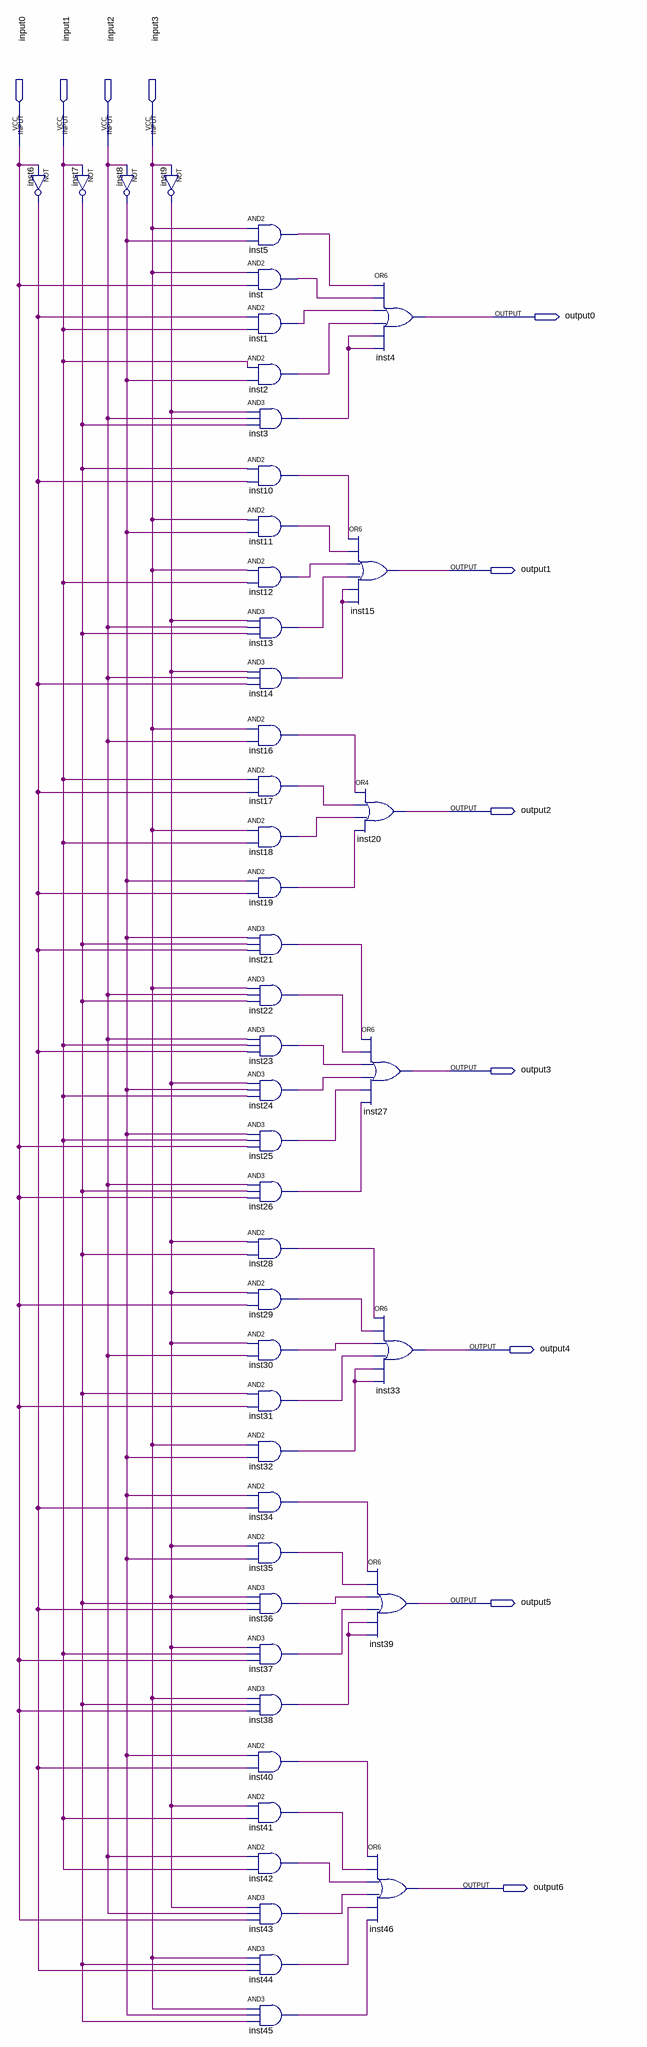
[diagram p0: schematic sheet]
// Quartus schematic segled.bdf as structural Verilog: 47 symbols, 11 pins
module segled (
  input  input0,
  input  input1,
  input  input2,
  input  input3,
  output output0,
  output output1,
  output output2,
  output output3,
  output output4,
  output output5,
  output output6
);

  wire inst1_out, inst2_out, inst3_out, inst5_out, inst6_out, inst7_out, inst8_out, inst9_out, inst10_out,
       inst11_out, inst12_out, inst13_out, inst14_out, inst16_out, inst17_out, inst18_out, inst19_out,
       inst21_out, inst22_out, inst23_out, inst24_out, inst25_out, inst26_out, inst28_out, inst29_out,
       inst30_out, inst31_out, inst32_out, inst34_out, inst35_out, inst36_out, inst37_out, inst38_out,
       inst40_out, inst41_out, inst42_out, inst43_out, inst44_out, inst45_out, inst_out;

  not inst6 (inst6_out, input0);
  not inst7 (inst7_out, input1);
  not inst8 (inst8_out, input2);
  not inst9 (inst9_out, input3);
  and inst5 (inst5_out, input3, inst8_out);
  and inst (inst_out, input3, input0);
  and inst1 (inst1_out, inst6_out, input1);
  and inst2 (inst2_out, input1, inst8_out);
  and inst3 (inst3_out, inst9_out, input2, inst7_out);
  and inst10 (inst10_out, inst7_out, inst6_out);
  and inst11 (inst11_out, input3, inst8_out);
  and inst12 (inst12_out, input3, input1);
  and inst13 (inst13_out, inst9_out, input2, inst7_out);
  and inst14 (inst14_out, inst9_out, input2, inst6_out);
  and inst16 (inst16_out, input3, input2);
  and inst17 (inst17_out, input1, inst6_out);
  and inst18 (inst18_out, input3, input1);
  and inst19 (inst19_out, inst8_out, inst6_out);
  and inst21 (inst21_out, inst8_out, inst7_out, inst6_out);
  and inst22 (inst22_out, input3, input2, inst7_out);
  and inst23 (inst23_out, input2, input1, inst6_out);
  and inst24 (inst24_out, inst9_out, inst8_out, input1);
  and inst25 (inst25_out, inst8_out, input1, input0);
  and inst26 (inst26_out, input2, inst7_out, input0);
  and inst28 (inst28_out, inst9_out, inst7_out);
  and inst29 (inst29_out, inst9_out, input0);
  and inst30 (inst30_out, inst9_out, input2);
  and inst31 (inst31_out, inst7_out, input0);
  and inst32 (inst32_out, input3, inst8_out);
  and inst34 (inst34_out, inst8_out, inst6_out);
  and inst35 (inst35_out, inst9_out, inst8_out);
  and inst36 (inst36_out, inst9_out, inst7_out, inst6_out);
  and inst37 (inst37_out, inst9_out, input1, input0);
  and inst38 (inst38_out, input3, inst7_out, input0);
  and inst40 (inst40_out, inst8_out, inst6_out);
  and inst41 (inst41_out, inst9_out, input1);
  and inst42 (inst42_out, input2, input1);
  and inst43 (inst43_out, inst9_out, input2, input0);
  and inst44 (inst44_out, input3, inst7_out, inst6_out);
  and inst45 (inst45_out, input3, inst8_out, inst7_out);
  or inst15 (output1, inst10_out, inst11_out, inst12_out, inst13_out, inst14_out, inst14_out);
  or inst4 (output0, inst5_out, inst_out, inst1_out, inst2_out, inst3_out, inst3_out);
  or inst20 (output2, inst16_out, inst17_out, inst18_out, inst19_out);
  or inst27 (output3, inst21_out, inst22_out, inst23_out, inst24_out, inst25_out, inst26_out);
  or inst33 (output4, inst28_out, inst29_out, inst30_out, inst31_out, inst32_out, inst32_out);
  or inst39 (output5, inst34_out, inst35_out, inst36_out, inst37_out, inst38_out, inst38_out);
  or inst46 (output6, inst40_out, inst41_out, inst42_out, inst43_out, inst44_out, inst45_out);
endmodule
